# Altium schematic sheet CAN Termination Board.SchDoc
size B
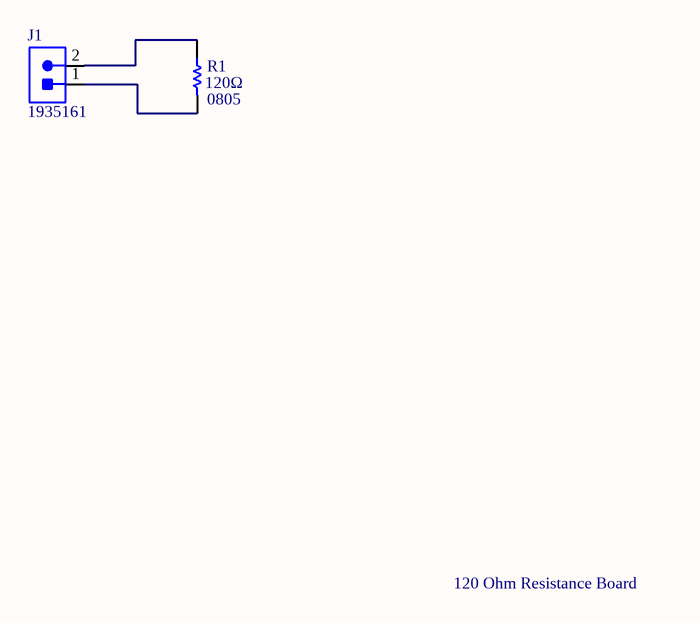
[diagram p0: CAN Termination Board.SchDoc]

## Parts
J1  CON_2M_TERM  [1935161]  (value not drawn)
R1  Package/Footprint: 0805  Resistance: 120Ω  [RESC0805]  (hidden comment: RES_120Ω_0805_1%)

## Nets
NetJ1_1: J1.1 R1.2
NetJ1_2: J1.2 R1.1

## Notes on the sheet
- 120 Ohm Resistance Board
- Title:
- Project:
- Date:
- Rev:
- Reviewer:
- Engineer:
- Sheet:
- of

## Library data of the parts
J1 = CON_2M_TERM: TERM BLK 2POS SIDE ENTRY 5MM; Manufacturer 1: Phoenix Contact; Max Current Rating: 16A; Current: 18A; Voltage: 300V; Package/Footprint: SMD; Supplier 1: Digi-Key; Supplier Part Number 1: 277-1667-ND; Manufacturer Part Number 1: 1935161; Mounting Type: TH
R1 = RES_120Ω_0805_1%: RES 120 OHM 1% 1/8W 0805; Manufacturer 1: Vishay; Manufacturer Part Number 1: CRCW0805120RFKEA; Supplier 1: Digi-Key; Mounting Type: SMD; Supplier Part Number 1: 541-120CCT-ND; LCSC Part #: C17437